# EAGLE design 03-ToF (EAGLE 9.6.2)

## Sheet 1 of 3
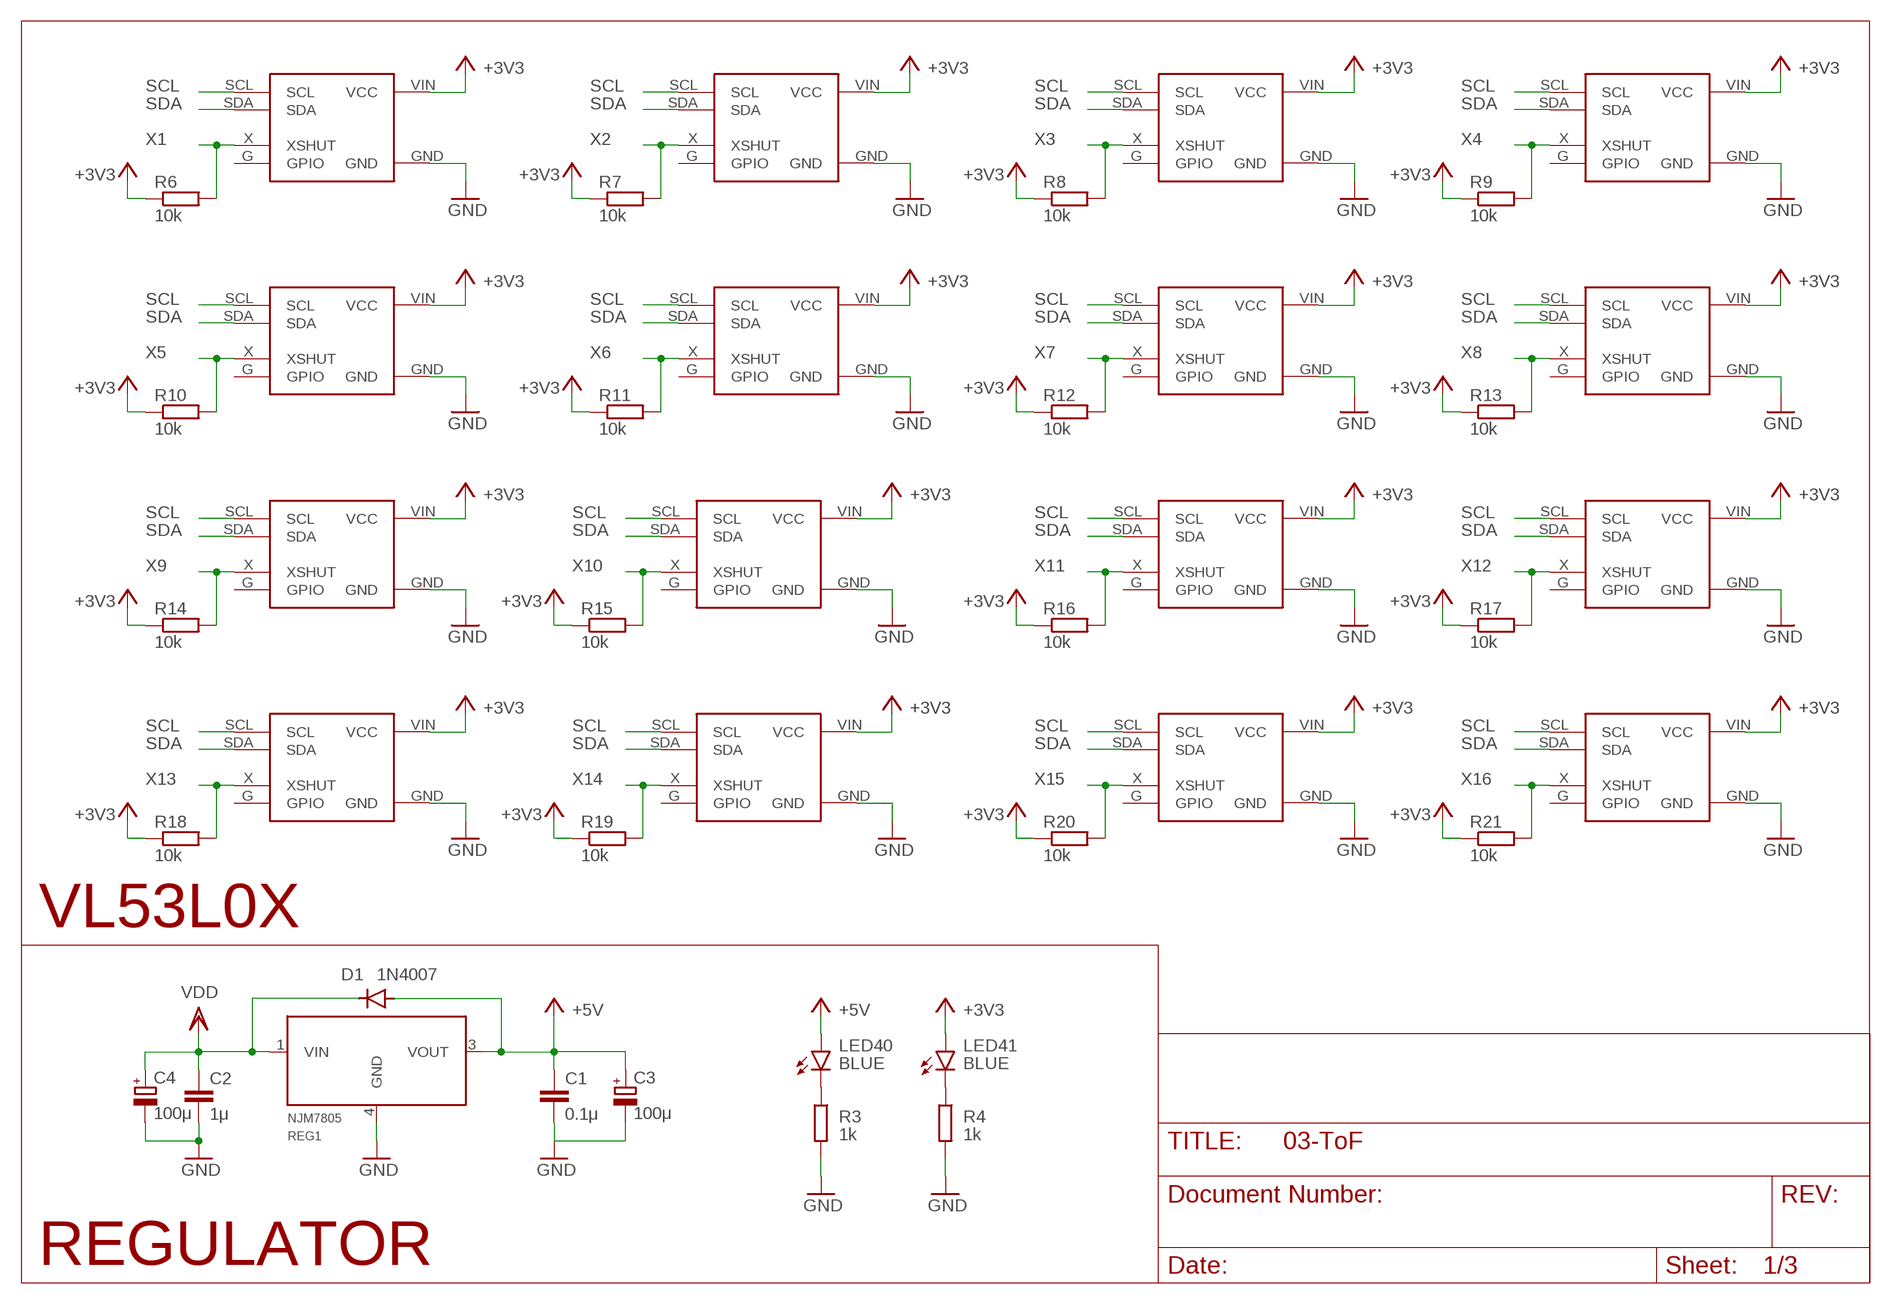
[diagram p0: schematic, sheet 1]

### Parts
C1  0.1μ  C-EUC0402  [C0402]
C2  1μ  C-EUC0402  [C0402]
C3  100μ  CPOL-EU153CLV-0505  [153CLV-0505]
C4  100μ  CPOL-EU153CLV-0505  [153CLV-0505]
D1  1N4007  GF1  [SMA-DO214AC]
LED40  BLUE  LEDSML0603  [SML0603]
LED41  BLUE  LEDSML0603  [SML0603]
R3  1k  R-EU_R0402  [R0402]
R4  1k  R-EU_R0402  [R0402]
R6  10k  R-EU_R0402  [R0402]
R7  10k  R-EU_R0402  [R0402]
R8  10k  R-EU_R0402  [R0402]
R9  10k  R-EU_R0402  [R0402]
R10  10k  R-EU_R0402  [R0402]
R11  10k  R-EU_R0402  [R0402]
R12  10k  R-EU_R0402  [R0402]
R13  10k  R-EU_R0402  [R0402]
R14  10k  R-EU_R0402  [R0402]
R15  10k  R-EU_R0402  [R0402]
R16  10k  R-EU_R0402  [R0402]
R17  10k  R-EU_R0402  [R0402]
R18  10k  R-EU_R0402  [R0402]
R19  10k  R-EU_R0402  [R0402]
R20  10k  R-EU_R0402  [R0402]
R21  10k  R-EU_R0402  [R0402]
REG1  NJM7805  MYPARTS_NJM7800S-REGULATOR  [MYPARTS_D-PAK_TO252AA]
VL1  VL53L0X  [1X04]
VL2  VL53L0X  [1X04]
VL3  VL53L0X  [1X04]
VL4  VL53L0X  [1X04]
VL5  VL53L0X  [1X04]
VL6  VL53L0X  [1X04]
VL7  VL53L0X  [1X04]
VL8  VL53L0X  [1X04]
VL9  VL53L0X  [1X04]
VL10  VL53L0X  [1X04]
VL11  VL53L0X  [1X04]
VL12  VL53L0X  [1X04]
VL13  VL53L0X  [1X04]
VL14  VL53L0X  [1X04]
VL15  VL53L0X  [1X04]
VL16  VL53L0X  [1X04]

### Nets
+3V3 [PWR]: LED41.A R6.1 R7.1 R8.1 R9.1 R10.1 R11.1 R12.1 R13.1 R14.1 R15.1 R16.1 R17.1 R18.1 R19.1 R20.1 R21.1 VL1.VIN(VCC) VL2.VIN(VCC) VL3.VIN(VCC) VL4.VIN(VCC) VL5.VIN(VCC) VL6.VIN(VCC) VL7.VIN(VCC) VL8.VIN(VCC) VL9.VIN(VCC) VL10.VIN(VCC) VL11.VIN(VCC) VL12.VIN(VCC) VL13.VIN(VCC) VL14.VIN(VCC) VL15.VIN(VCC) VL16.VIN(VCC) ; also sheet 2
+5V [PWR]: C1.1 C3.+ D1.A LED40.A REG1.3(VOUT) ; also sheet 2,3
GND [PWR]: C1.2 C2.2 C3.- C4.- R3.2 R4.2 REG1.4(GND) VL1.GND VL2.GND VL3.GND VL4.GND VL5.GND VL6.GND VL7.GND VL8.GND VL9.GND VL10.GND VL11.GND VL12.GND VL13.GND VL14.GND VL15.GND VL16.GND ; also sheet 2,3
N$23: LED40.C R3.1
N$24: LED41.C R4.1
SCL: VL1.SCL VL2.SCL VL3.SCL VL4.SCL VL5.SCL VL6.SCL VL7.SCL VL8.SCL VL9.SCL VL10.SCL VL11.SCL VL12.SCL VL13.SCL VL14.SCL VL15.SCL VL16.SCL ; also sheet 2
SDA: VL1.SDA VL2.SDA VL3.SDA VL4.SDA VL5.SDA VL6.SDA VL7.SDA VL8.SDA VL9.SDA VL10.SDA VL11.SDA VL12.SDA VL13.SDA VL14.SDA VL15.SDA VL16.SDA ; also sheet 2
VDD [PWR]: C2.1 C4.+ D1.K(C) REG1.1(VIN) ; also sheet 2
X1 [XSHUT]: R6.2 VL1.X(XSHUT) ; also sheet 2
X2 [XSHUT]: R7.2 VL2.X(XSHUT) ; also sheet 2
X3 [XSHUT]: R8.2 VL3.X(XSHUT) ; also sheet 2
X4 [XSHUT]: R9.2 VL4.X(XSHUT) ; also sheet 2
X5 [XSHUT]: R10.2 VL5.X(XSHUT) ; also sheet 2
X6 [XSHUT]: R11.2 VL6.X(XSHUT) ; also sheet 2
X7 [XSHUT]: R12.2 VL7.X(XSHUT) ; also sheet 2
X8 [XSHUT]: R13.2 VL8.X(XSHUT) ; also sheet 2
X9 [XSHUT]: R14.2 VL9.X(XSHUT) ; also sheet 2
X10 [XSHUT]: R15.2 VL10.X(XSHUT) ; also sheet 2
X11 [XSHUT]: R16.2 VL11.X(XSHUT) ; also sheet 2
X12 [XSHUT]: R17.2 VL12.X(XSHUT) ; also sheet 2
X13 [XSHUT]: R18.2 VL13.X(XSHUT) ; also sheet 2
X14 [XSHUT]: R19.2 VL14.X(XSHUT) ; also sheet 2
X15 [XSHUT]: R20.2 VL15.X(XSHUT) ; also sheet 2
X16 [XSHUT]: R21.2 VL16.X(XSHUT) ; also sheet 2
Unconnected: VL1.G(GPIO) VL2.G(GPIO) VL3.G(GPIO) VL4.G(GPIO) VL5.G(GPIO) VL6.G(GPIO) VL7.G(GPIO) VL8.G(GPIO) VL9.G(GPIO) VL10.G(GPIO) VL11.G(GPIO) VL12.G(GPIO) VL13.G(GPIO) VL14.G(GPIO) VL15.G(GPIO) VL16.G(GPIO)

### Notes on the sheet
- VL53L0X
- REGULATOR

## Sheet 2 of 3
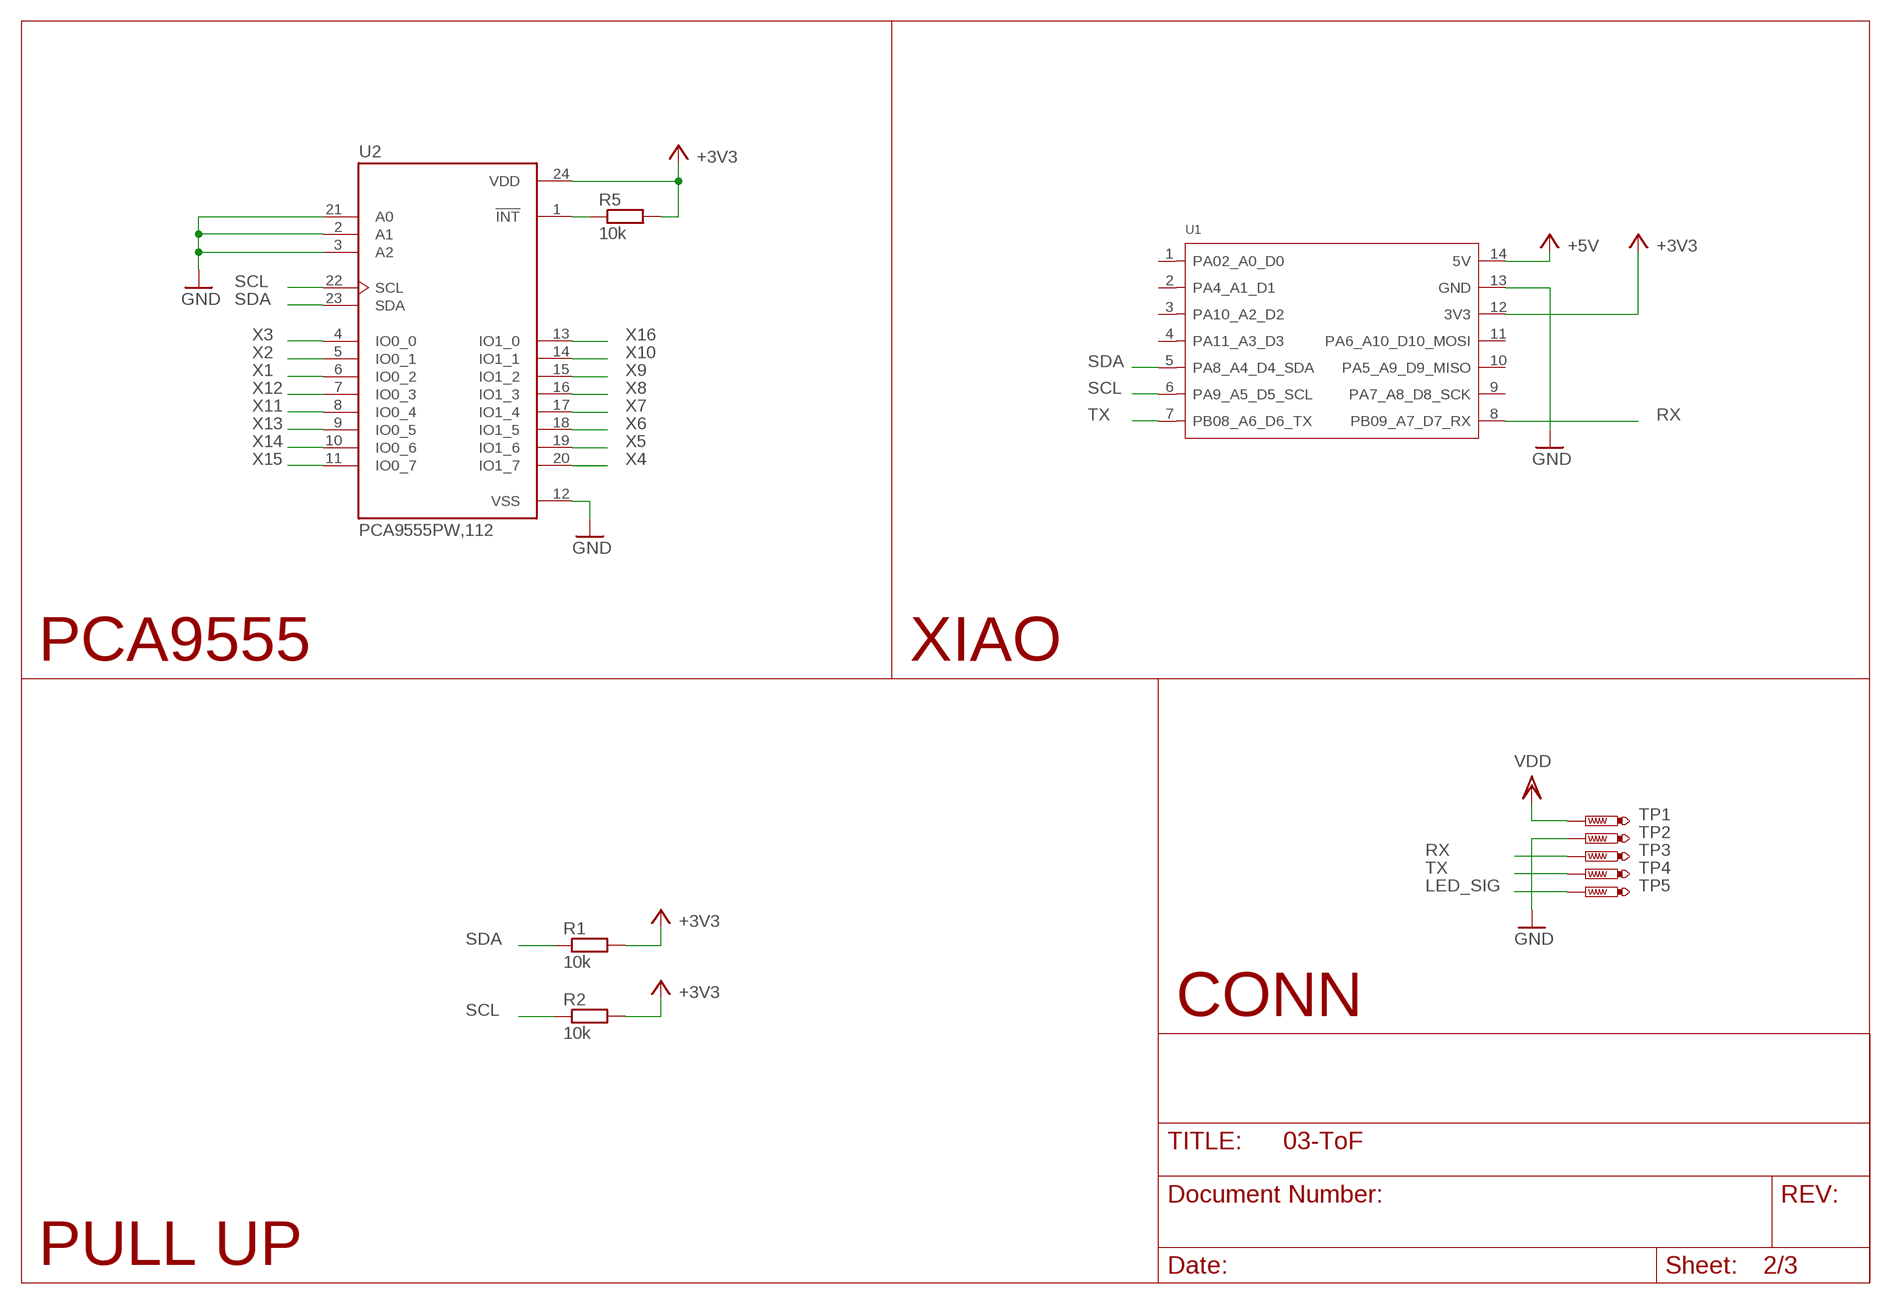
[diagram p1: schematic, sheet 2]

### Parts
R1  10k  R-EU_R0402  [R0402]
R2  10k  R-EU_R0402  [R0402]
R5  10k  R-EU_R0402  [R0402]
TP1  PTR1TP10R  [TP10R]
TP2  PTR1TP10SQ  [TP10SQ]
TP3  PTR1TP10R  [TP10R]
TP4  PTR1TP10R  [TP10R]
TP5  PTR1TP10R  [TP10R]
U1  MOUDLE-SEEEDUINO-XIAO  [MOUDLE14P-2.54-21X17.8MM]
U2  PCA9555PW,112  [SOP65P640X110-24N]

### Nets
+3V3 [PWR]: R1.2 R2.2 R5.2 U1.12(3V3) U2.24(VDD) ; also sheet 1
+5V [PWR]: U1.14(5V) ; also sheet 1,3
GND [PWR]: TP2.TP U1.13(GND) U2.2(A1) U2.3(A2) U2.12(VSS) U2.21(A0) ; also sheet 1,3
LED_SIG: TP5.TP ; also sheet 3
N$25: R5.1 U2.1(!INT)
RX: TP3.TP U1.8(PB09_A7_D7_RX)
SCL: R2.1 U1.6(PA9_A5_D5_SCL) U2.22(SCL) ; also sheet 1
SDA: R1.1 U1.5(PA8_A4_D4_SDA) U2.23(SDA) ; also sheet 1
TX: TP4.TP U1.7(PB08_A6_D6_TX)
VDD [PWR]: TP1.TP ; also sheet 1
X1 [XSHUT]: U2.6(IO0_2) ; also sheet 1
X2 [XSHUT]: U2.5(IO0_1) ; also sheet 1
X3 [XSHUT]: U2.4(IO0_0) ; also sheet 1
X4 [XSHUT]: U2.20(IO1_7) ; also sheet 1
X5 [XSHUT]: U2.19(IO1_6) ; also sheet 1
X6 [XSHUT]: U2.18(IO1_5) ; also sheet 1
X7 [XSHUT]: U2.17(IO1_4) ; also sheet 1
X8 [XSHUT]: U2.16(IO1_3) ; also sheet 1
X9 [XSHUT]: U2.15(IO1_2) ; also sheet 1
X10 [XSHUT]: U2.14(IO1_1) ; also sheet 1
X11 [XSHUT]: U2.8(IO0_4) ; also sheet 1
X12 [XSHUT]: U2.7(IO0_3) ; also sheet 1
X13 [XSHUT]: U2.9(IO0_5) ; also sheet 1
X14 [XSHUT]: U2.10(IO0_6) ; also sheet 1
X15 [XSHUT]: U2.11(IO0_7) ; also sheet 1
X16 [XSHUT]: U2.13(IO1_0) ; also sheet 1
Unconnected: U1.1(PA02_A0_D0) U1.2(PA4_A1_D1) U1.3(PA10_A2_D2) U1.4(PA11_A3_D3) U1.9(PA7_A8_D8_SCK) U1.10(PA5_A9_D9_MISO) U1.11(PA6_A10_D10_MOSI)

### Notes on the sheet
- PCA9555 | XIAO
- CONN
- PULL UP

## Sheet 3 of 3
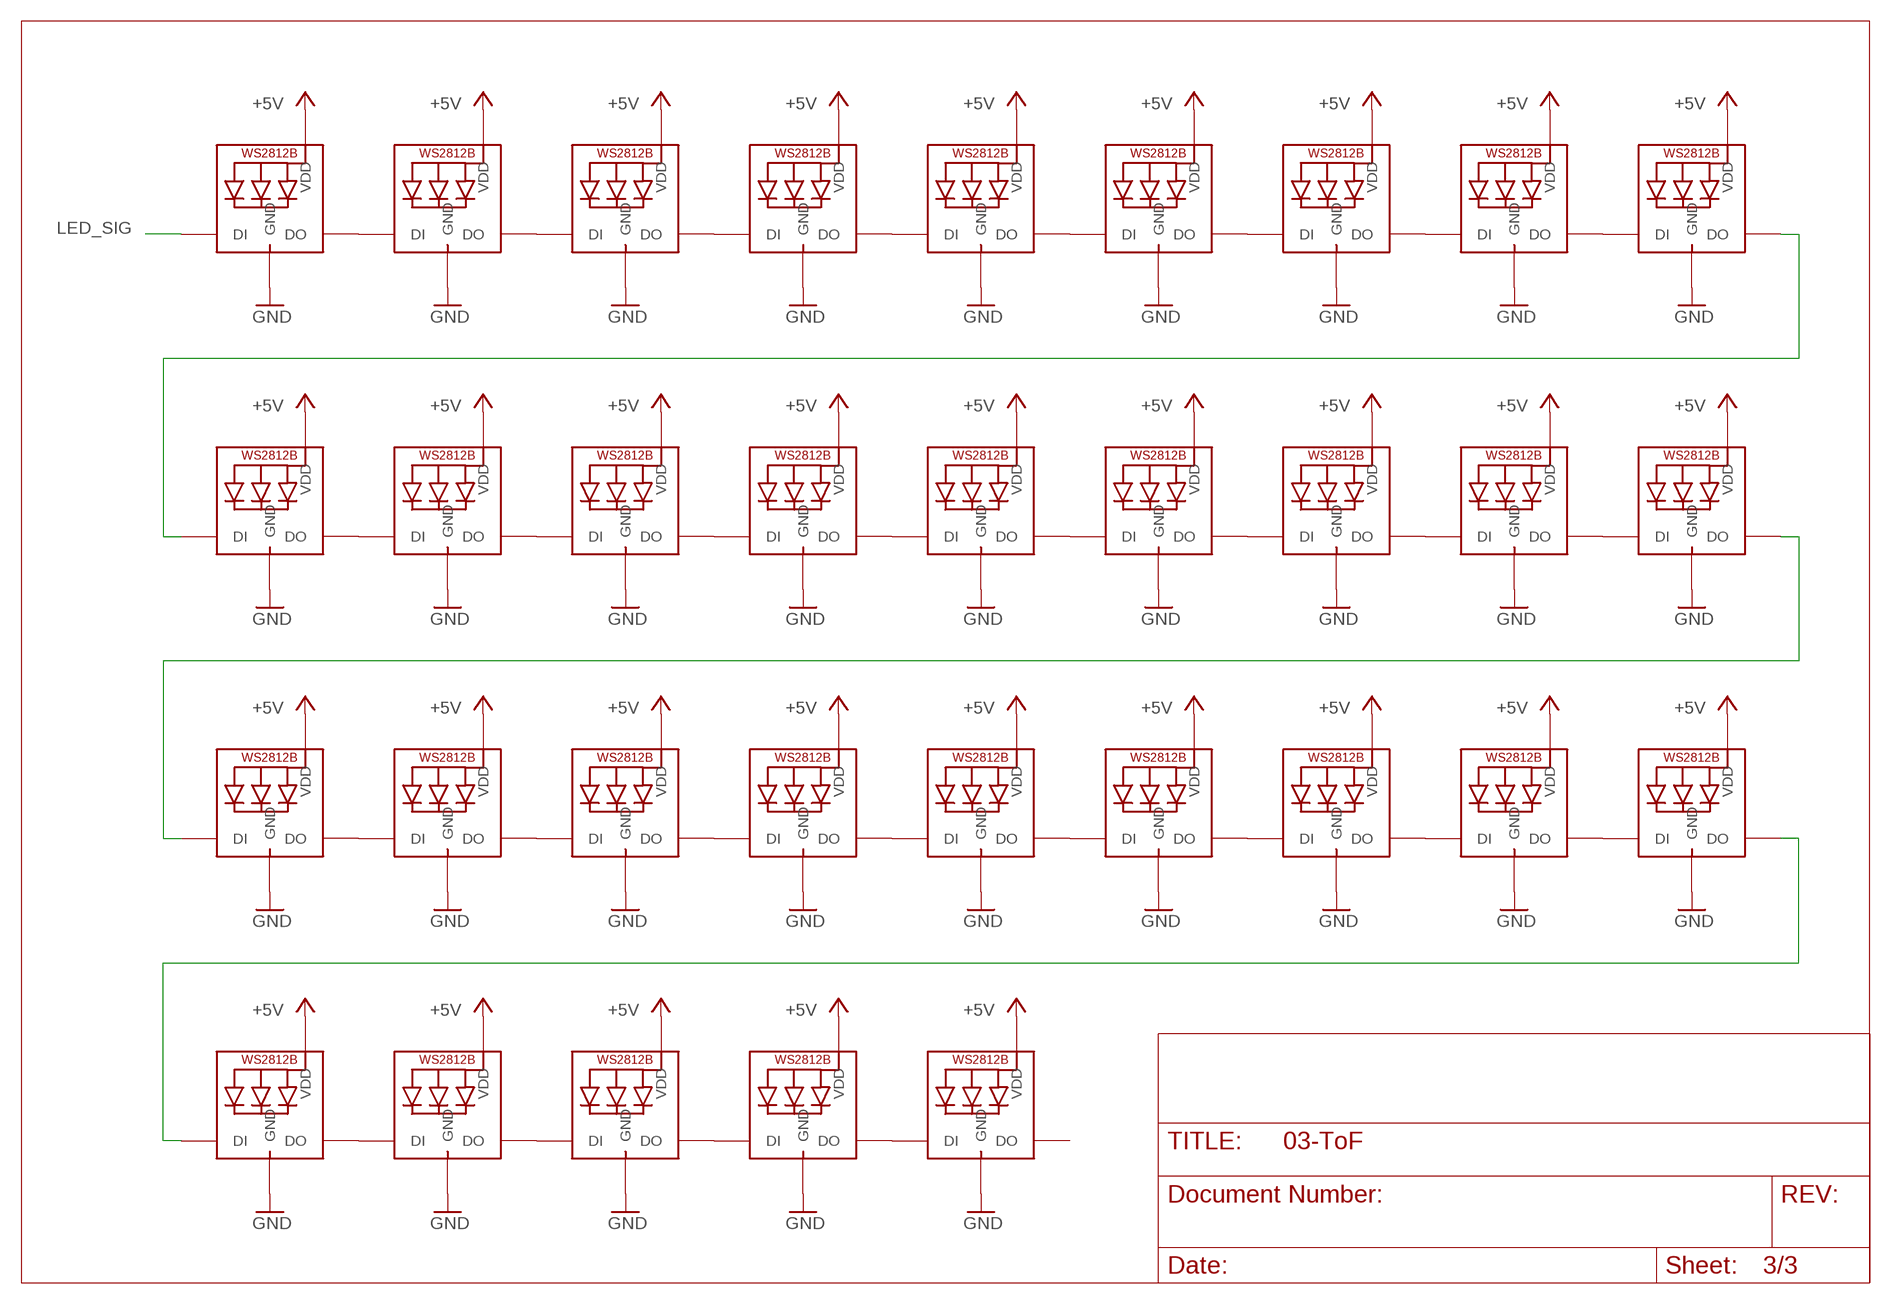
[diagram p2: schematic, sheet 3]

### Parts
LED1  WS2812B_5050N  [WS2812B-NARROW]
LED2  WS2812B_5050N  [WS2812B-NARROW]
LED3  WS2812B_5050N  [WS2812B-NARROW]
LED4  WS2812B_5050N  [WS2812B-NARROW]
LED5  WS2812B_5050N  [WS2812B-NARROW]
LED6  WS2812B_5050N  [WS2812B-NARROW]
LED7  WS2812B_5050N  [WS2812B-NARROW]
LED8  WS2812B_5050N  [WS2812B-NARROW]
LED9  WS2812B_5050N  [WS2812B-NARROW]
LED10  WS2812B_5050N  [WS2812B-NARROW]
LED11  WS2812B_5050N  [WS2812B-NARROW]
LED12  WS2812B_5050N  [WS2812B-NARROW]
LED13  WS2812B_5050N  [WS2812B-NARROW]
LED14  WS2812B_5050N  [WS2812B-NARROW]
LED15  WS2812B_5050N  [WS2812B-NARROW]
LED16  WS2812B_5050N  [WS2812B-NARROW]
LED17  WS2812B_5050N  [WS2812B-NARROW]
LED18  WS2812B_5050N  [WS2812B-NARROW]
LED19  WS2812B_5050N  [WS2812B-NARROW]
LED20  WS2812B_5050N  [WS2812B-NARROW]
LED21  WS2812B_5050N  [WS2812B-NARROW]
LED22  WS2812B_5050N  [WS2812B-NARROW]
LED23  WS2812B_5050N  [WS2812B-NARROW]
LED24  WS2812B_5050N  [WS2812B-NARROW]
LED25  WS2812B_5050N  [WS2812B-NARROW]
LED26  WS2812B_5050N  [WS2812B-NARROW]
LED27  WS2812B_5050N  [WS2812B-NARROW]
LED28  WS2812B_5050N  [WS2812B-NARROW]
LED29  WS2812B_5050N  [WS2812B-NARROW]
LED30  WS2812B_5050N  [WS2812B-NARROW]
LED31  WS2812B_5050N  [WS2812B-NARROW]
LED32  WS2812B_5050N  [WS2812B-NARROW]

### Nets
+5V [PWR]: LED1.1-VDD(VDD) LED2.1-VDD(VDD) LED3.1-VDD(VDD) LED4.1-VDD(VDD) LED5.1-VDD(VDD) LED6.1-VDD(VDD) LED7.1-VDD(VDD) LED8.1-VDD(VDD) LED9.1-VDD(VDD) LED10.1-VDD(VDD) LED11.1-VDD(VDD) LED12.1-VDD(VDD) LED13.1-VDD(VDD) LED14.1-VDD(VDD) LED15.1-VDD(VDD) LED16.1-VDD(VDD) LED17.1-VDD(VDD) LED18.1-VDD(VDD) LED19.1-VDD(VDD) LED20.1-VDD(VDD) LED21.1-VDD(VDD) LED22.1-VDD(VDD) LED23.1-VDD(VDD) LED24.1-VDD(VDD) LED25.1-VDD(VDD) LED26.1-VDD(VDD) LED27.1-VDD(VDD) LED28.1-VDD(VDD) LED29.1-VDD(VDD) LED30.1-VDD(VDD) LED31.1-VDD(VDD) LED32.1-VDD(VDD) ; also sheet 1,2
GND [PWR]: LED1.3-GND(GND) LED2.3-GND(GND) LED3.3-GND(GND) LED4.3-GND(GND) LED5.3-GND(GND) LED6.3-GND(GND) LED7.3-GND(GND) LED8.3-GND(GND) LED9.3-GND(GND) LED10.3-GND(GND) LED11.3-GND(GND) LED12.3-GND(GND) LED13.3-GND(GND) LED14.3-GND(GND) LED15.3-GND(GND) LED16.3-GND(GND) LED17.3-GND(GND) LED18.3-GND(GND) LED19.3-GND(GND) LED20.3-GND(GND) LED21.3-GND(GND) LED22.3-GND(GND) LED23.3-GND(GND) LED24.3-GND(GND) LED25.3-GND(GND) LED26.3-GND(GND) LED27.3-GND(GND) LED28.3-GND(GND) LED29.3-GND(GND) LED30.3-GND(GND) LED31.3-GND(GND) LED32.3-GND(GND) ; also sheet 1,2
LED_SIG: LED1.4-DIN(DI) ; also sheet 2
N$1: LED1.2-DOUT(DO) LED2.4-DIN(DI)
N$2: LED2.2-DOUT(DO) LED3.4-DIN(DI)
N$3: LED3.2-DOUT(DO) LED4.4-DIN(DI)
N$4: LED4.2-DOUT(DO) LED5.4-DIN(DI)
N$5: LED5.2-DOUT(DO) LED6.4-DIN(DI)
N$6: LED6.2-DOUT(DO) LED7.4-DIN(DI)
N$7: LED7.2-DOUT(DO) LED8.4-DIN(DI)
N$8: LED8.2-DOUT(DO) LED9.4-DIN(DI)
N$9: LED10.2-DOUT(DO) LED11.4-DIN(DI)
N$10: LED11.2-DOUT(DO) LED12.4-DIN(DI)
N$11: LED12.2-DOUT(DO) LED13.4-DIN(DI)
N$12: LED13.2-DOUT(DO) LED14.4-DIN(DI)
N$13: LED14.2-DOUT(DO) LED15.4-DIN(DI)
N$14: LED15.2-DOUT(DO) LED16.4-DIN(DI)
N$15: LED16.2-DOUT(DO) LED17.4-DIN(DI)
N$16: LED17.2-DOUT(DO) LED18.4-DIN(DI)
N$17: LED19.2-DOUT(DO) LED20.4-DIN(DI)
N$18: LED20.2-DOUT(DO) LED21.4-DIN(DI)
N$19: LED21.2-DOUT(DO) LED22.4-DIN(DI)
N$20: LED22.2-DOUT(DO) LED23.4-DIN(DI)
N$21: LED23.2-DOUT(DO) LED24.4-DIN(DI)
N$22: LED24.2-DOUT(DO) LED25.4-DIN(DI)
N$26: LED25.2-DOUT(DO) LED26.4-DIN(DI)
N$27: LED26.2-DOUT(DO) LED27.4-DIN(DI)
N$28: LED9.2-DOUT(DO) LED10.4-DIN(DI)
N$29: LED28.2-DOUT(DO) LED29.4-DIN(DI)
N$30: LED29.2-DOUT(DO) LED30.4-DIN(DI)
N$31: LED30.2-DOUT(DO) LED31.4-DIN(DI)
N$32: LED31.2-DOUT(DO) LED32.4-DIN(DI)
N$33: LED18.2-DOUT(DO) LED19.4-DIN(DI)
N$34: LED27.2-DOUT(DO) LED28.4-DIN(DI)
Unconnected: LED32.2-DOUT(DO)

## Library data of the parts
C1 C2 = rcl:C-EU: CAPACITOR, European symbol; SPICEPREFIX: C
C3 C4 = rcl:CPOL-EU: POLARIZED CAPACITOR, European symbol; SPICEPREFIX: C
D1 = diode:GF1: DIODE
LED1-LED32 = microbuilder:WS2812B
LED40 LED41 = led:LED: LED OSRAM: - CHIPLED LG R971, LG N971, LY N971, LG Q971, LY Q971, LO R971, LY R971 LH N974, LH R974 LS Q976, LO Q976, LY Q976 LO Q996 - Hyper CHIPLED LW Q18S LB Q993, LB Q99A, LB R99A - SideLED LS A670, LO A670, LY A670, LG A670, LP A670 LB A673, LV A673, LT A673, LW A673 LH A674 LY A675 LS A676, LA A676, LO A676, LY A676, LW A676 LS A679, LY A679, LG A679 - Hyper Micro SIDELED® LS Y876, LA Y876, LO Y876, LY Y876 LT Y87S - SmartLED LW L88C, LW L88S LB L89C, LB L89S, LG L890 LS L89K, LO L89K, LY L89K LS L896, LA L896, LO L896, LY L896 - TOPLED LS T670, LO T670, LY T670, LG T670, LP T670 LSG T670, LSP T670, LSY T670, LOP T670, LYG T670 LG T671, LOG T671, LSG T671 LB T673, LV T673, LT T673, LW T673 LH T674 LS T676, LA T676, LO T676, LY T676, LB T676, LH T676, LSB T676, LW T676 LB T67C, LV T67C, LT T67C, LS T67K, LO T67K, LY T67K, LW E67C LS E67B, LA E67B, LO E67B, LY E67B, LB E67C, LV E67C, LT E67C LW T67C LS T679, LY T679, LG T679 LS T770, LO T770, LY T770, LG T770, LP T770 LB T773, LV T773, LT T773, LW T773 LH T774 LS E675, LA E675, LY E675, LS T675 LS T776, LA T776, LO T776, LY T776, LB T776 LHGB T686 LT T68C, LB T68C - Hyper Mini TOPLED® LB M676 - Mini TOPLED Santana® LG M470 LS M47K, LO M47K, LY M47K Source: http://www.osram.convergy.de LUXEON: - LUMILED® LXK2-PW12-R00, LXK2-PW12-S00, LXK2-PW14-U00, LXK2-PW14-V00 LXK2-PM12-R00, LXK2-PM12-S00, LXK2-PM14-U00 LXK2-PE12-Q00, LXK2-PE12-R00, LXK2-PE12-S00, LXK2-PE14-T00, LXK2-PE14-U00 LXK2-PB12-K00, LXK2-PB12-L00, LXK2-PB12-M00, LXK2-PB14-N00, LXK2-PB14-P00, LXK2-PB14-Q00 LXK2-PR12-L00, LXK2-PR12-M00, LXK2-PR14-Q00, LXK2-PR14-R00 LXK2-PD12-Q00, LXK2-PD12-R00, LXK2-PD12-S00 LXK2-PH12-R00, LXK2-PH12-S00 LXK2-PL12-P00, LXK2-PL12-Q00, LXK2-PL12-R00 Source: www.luxeon.com KINGBRIGHT: KA-3528ASYC Source: www.kingbright.com
R1-R21 = rcl:R-EU_: RESISTOR, European symbol; SPICEPREFIX: R
REG1 = #001-line:MYPARTS_NJM7800S-REGULATOR
TP1-TP5 = testpad:PTR1: TEST PIN
U1 = Seeeduino XIAO:MOUDLE-SEEEDUINO-XIAO
U2 = PCA9555PW_112:PCA9555PW,112: Check availability <https://pricing.snapeda.com/parts/PCA9555PW%2C112/NXP%20Semiconductors/view-part?ref=eda>; AVAILABILITY: In Stock; DESCRIPTION: Interface IC - I/O extensions NXP Semiconductors PCA9555PW, 112 POR I²C, SMBus 400 kHz TSSOP 24; MF: NXP Semiconductors; MP: PCA9555PW,112; PACKAGE: TSSOP-24 NXP Semiconductors; PRICE: None; PURCHASE-URL: https://pricing.snapeda.com/search/part/PCA9555PW,112/?ref=eda
VL1-VL16 = VL53L0X:VL53L0X

## Net classes
0 default: width 0.381 mm
1 PWR: width 0.381 mm
2 XSHUT: width 0.254 mm

## Board
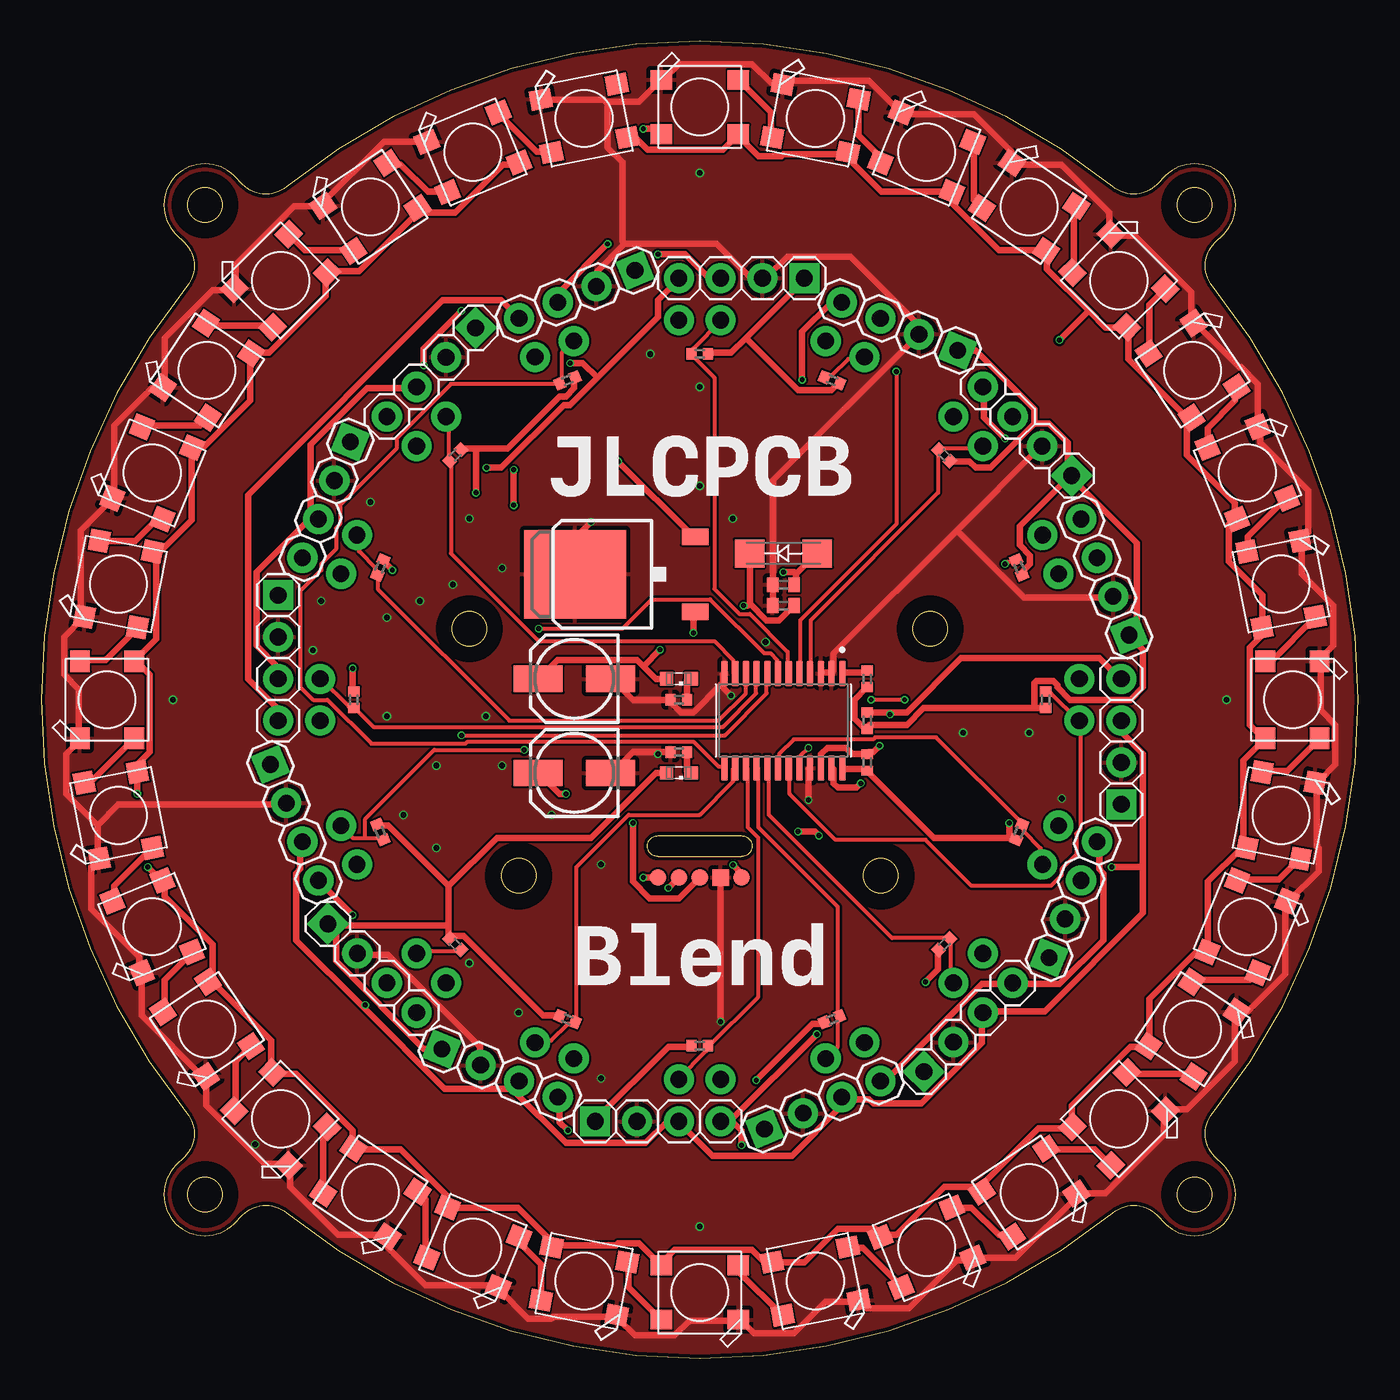
[diagram p3: board, top side]
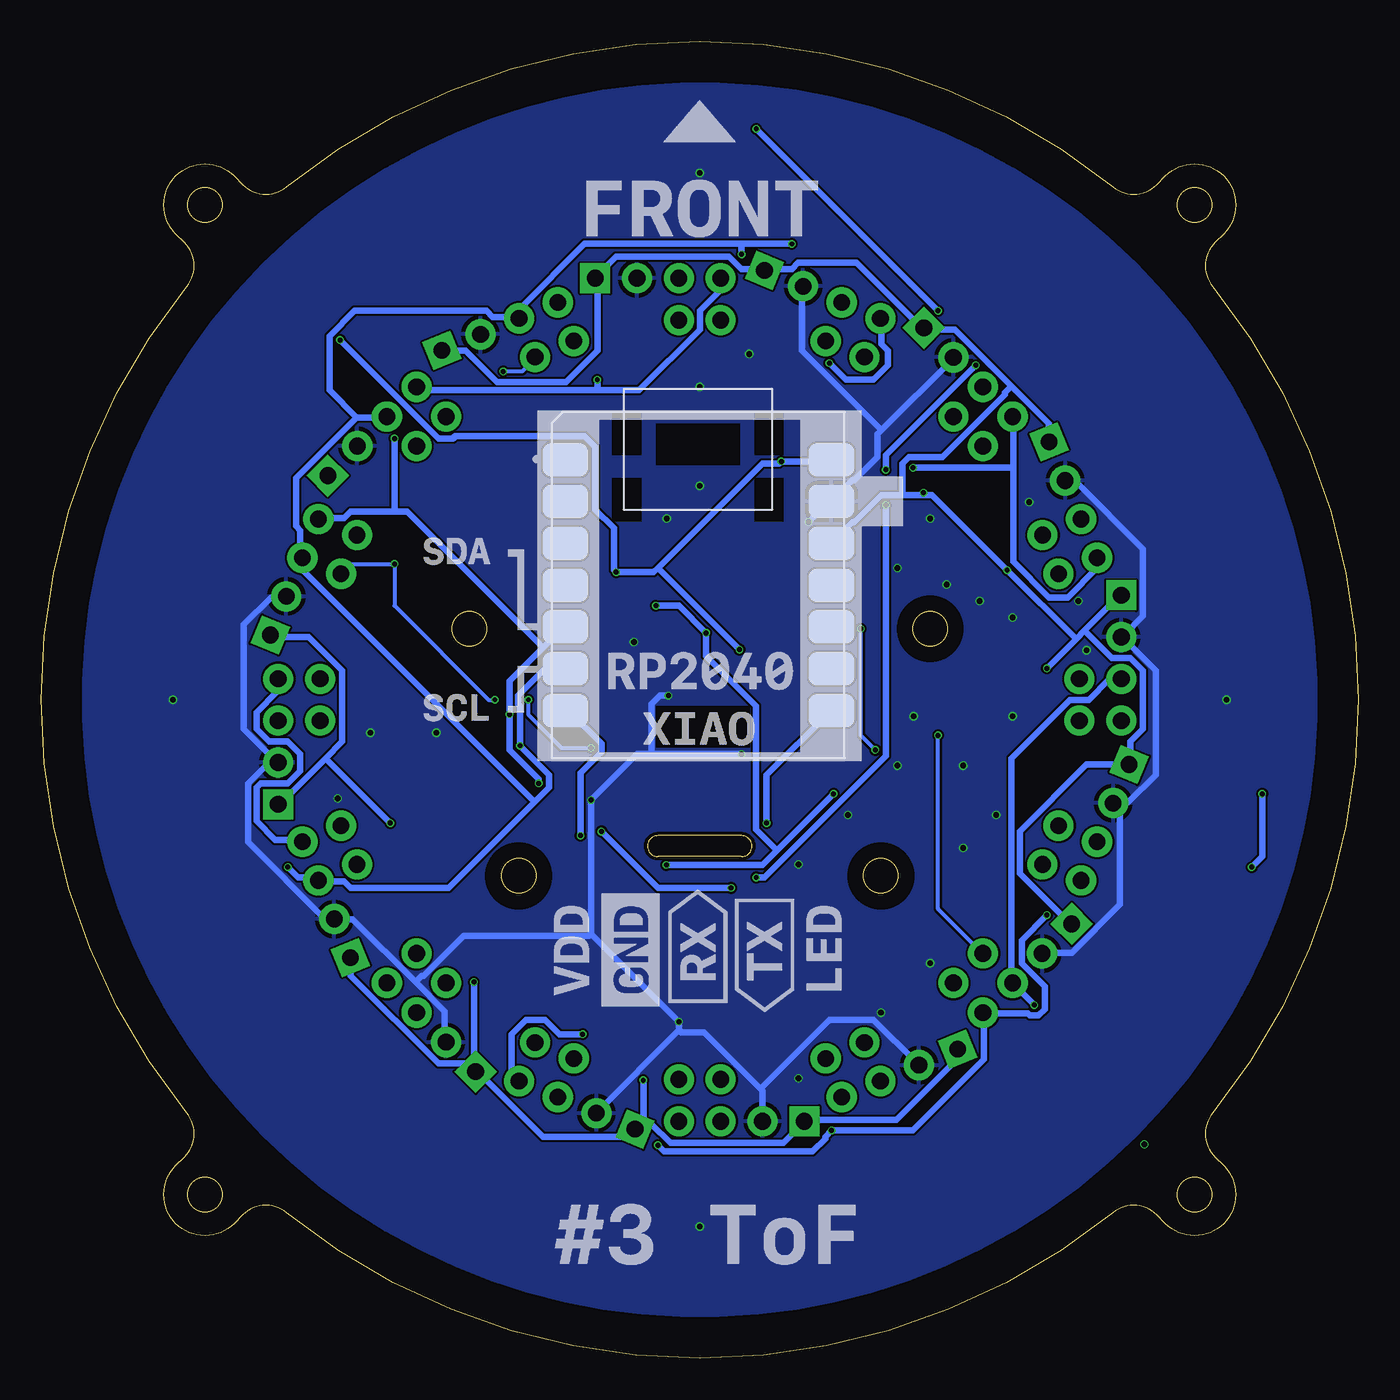
[diagram p4: board, bottom side, seen from below]

Size 80 x 80 mm. Coordinates in mm from the lower left corner, seen from the top.
Outline: 65.09,71.15 arc78 14.91,71.15 arc-84 12.24,71.3 11.72,71.82 arc180 8.18,68.28 8.71,67.76 arc-84 8.85,65.09 arc78 8.85,14.91 arc-84 8.71,12.24 8.18,11.72 arc180 11.72,8.18 12.24,8.71 arc-84 14.91,8.85 arc78 65.09,8.85 arc-84 67.76,8.71 68.28,8.18 arc180 71.82,11.72 71.3,12.24 arc-84 71.15,14.91 arc78 71.15,65.09 arc-84 71.3,67.76 71.82,68.28 arc180 68.28,71.82 67.76,71.3 arc-84 65.09,71.15
Outline: 37.46,31.75 42.54,31.75 arc-180 42.54,30.48 37.46,30.48 arc-180 37.46,31.75
Outline: circle at 51,29.3 radius 1.05
Outline: circle at 54,44.3 radius 1.05
Outline: circle at 29,29.3 radius 1.05
Outline: circle at 70.05,70.05 radius 1.05
Outline: circle at 70.05,9.95 radius 1.05
Outline: circle at 9.95,9.95 radius 1.05
Outline: circle at 9.95,70.05 radius 1.05
Outline: circle at 26,44.3 radius 1.05
Copper layers (1*16): Top 0.035mm / dielectric 1.6mm / Bottom 0.035mm
Design rules "jlcpcb-2layers": minimum track width 5mil, minimum drill 0.3mm, track to track 5mil, track to pad 5mil, pad to pad 5mil, via to via 5mil, smd to smd 5mil, copper to edge 0.2mm, drill to drill 6mil, minimum pad ring 10mil, minimum via ring 3mil, stop-mask expansion 4mil, vias tented up to drill 0mil, thermal gap 10mil
tRestrict: area 52,42.3 to 56,46.3; area 27,27.3 to 31,31.3; area 24,42.3 to 28,46.3; area 7.9,68.1 to 11.9,72.1; area 49,27.3 to 53,31.3; area 68.1,68.1 to 72.1,72.1; area 68.1,7.9 to 72.1,11.9; area 7.9,7.9 to 11.9,11.9
bRestrict: area 49,27.3 to 53,31.3; area 68.1,68.1 to 72.1,72.1; area 68.1,7.9 to 72.1,11.9; area 7.9,7.9 to 11.9,11.9; area 52,42.3 to 56,46.3; area 24,42.3 to 28,46.3; area 27,27.3 to 31,31.3; area 7.9,68.1 to 11.9,72.1

### Footprints (pad centres in the part's own frame; a part is rotated, then mirrored left to right if it is on the bottom)
C0402 = smd 0.7 x 0.9: 1 -0.65,0; 2 0.65,0
153CLV-0505 = smd 3 x 1.6: + 2.2,0; - -2.2,0
SMA-DO214AC = smd 1.8 x 1.7: A -2.05,0; K 2.05,0
WS2812B-NARROW = smd 1.3 x 1.2: 1-VDD 2.35,-1.65; 2-DOUT 2.35,1.65; 3-GND -2.35,1.65; 4-DIN -2.35,-1.65
SML0603 = smd 0.8 x 0.8: A 0.75,0; C -0.75,0
R0402 = smd 0.6 x 0.7: 1 -0.5,0; 2 0.5,0
MYPARTS_D-PAK_TO252AA = smd 1 x 1.6: 1 -2.28,-4.8; 3 2.28,-4.8 | smd 5.4 x 6.2: 4 0,2.5
TP10R = smd 1 x 1: TP 0,0
TP10SQ = smd 1 x 1: TP 0,0
MOUDLE14P-2.54-21X17.8MM = smd 2.75 x 2: 1 0.835,18.12; 2 0.835,15.58; 3 0.835,13.04; 4 0.835,10.5; 5 0.835,7.96; 6 0.835,5.42; 7 0.835,2.88; 8 17,2.88; 9 17,5.42; 10 17,7.96; 11 17,10.5; 12 17,13.04; 13 17,15.58; 14 17,18.12
SOP65P640X110-24N = smd 1.57 x 0.41: 1 -2.87,3.575; 2 -2.87,2.925; 3 -2.87,2.275; 4 -2.87,1.625; 5 -2.87,0.975; 6 -2.87,0.325; 7 -2.87,-0.325; 8 -2.87,-0.975; 9 -2.87,-1.625; 10 -2.87,-2.275; 11 -2.87,-2.925; 12 -2.87,-3.575; 13 2.87,-3.575; 14 2.87,-2.925; 15 2.87,-2.275; 16 2.87,-1.625; 17 2.87,-0.975; 18 2.87,-0.325; 19 2.87,0.325; 20 2.87,0.975; 21 2.87,1.625; 22 2.87,2.275; 23 2.87,2.925; 24 2.87,3.575
1X04 = drill 1.016: G -1.27,-2.54; GND 3.81,0; SCL 1.27,0; SDA -1.27,0; X 1.27,-2.54 | drill 1.016 square: VIN 6.35,0

### Placement (x,y rotation side)
C1  45.08,46.99 180 top
C2  45.08,45.72 180 top
C3  32.38,41.27 180 top
C4  32.38,35.56 180 top
D1  45.08,48.89 180 top
LED1  40,76 0 top
LED2  47.02,75.31 348.8 top
LED3  53.78,73.26 337.5 top
LED4  60,69.93 326.3 top
LED5  65.46,65.46 315 top
LED6  69.93,60 303.8 top
LED7  73.26,53.78 292.5 top
LED8  75.31,47.02 281.3 top
LED9  76,40 270 top
LED10  75.31,32.98 258.8 top
LED11  73.26,26.22 247.5 top
LED12  69.93,20 236.3 top
LED13  65.46,14.54 225 top
LED14  60,10.07 213.8 top
LED15  53.78,6.74 202.5 top
LED16  47.02,4.69 191.3 top
LED17  40,4 180 top
LED18  32.98,4.69 168.8 top
LED19  26.22,6.74 157.5 top
LED20  20,10.07 146.3 top
LED21  14.54,14.54 135 top
LED22  10.07,20 123.8 top
LED23  6.74,26.22 112.5 top
LED24  4.69,32.98 101.3 top
LED25  4,40 90 top
LED26  4.69,47.02 78.8 top
LED27  6.74,53.78 67.5 top
LED28  10.07,60 56.3 top
LED29  14.54,65.46 45 top
LED30  20,69.93 33.8 top
LED31  26.22,73.26 22.5 top
LED32  32.98,75.31 11.3 top
LED40  38.73,41.27 180 top
LED41  38.73,35.56 180 top
R1  50.16,38.73 270 top
R2  50.16,36.19 270 top
R3  38.73,40 180 top
R4  38.73,36.83 180 top
R5  50.16,41.27 270 top
R6  40,61 180 top
R7  48.04,59.4 157.5 top
R8  54.85,54.85 135 top
R9  59.4,48.04 112.5 top
R10  61,40 90 top
R11  59.4,31.96 67.5 top
R12  54.85,25.15 45 top
R13  48.04,20.6 22.5 top
R14  40,19 0 top
R15  31.96,20.6 337.5 top
R16  25.15,25.15 315 top
R17  20.6,31.96 292.5 top
R18  19,40 270 top
R19  20.6,48.04 247.5 top
R20  25.15,54.85 225 top
R21  31.96,59.4 202.5 top
REG1  34.92,47.62 90 top
TP1  42.54,29.21 0 top
TP2  41.27,29.21 0 top
TP3  40,29.21 0 top
TP4  38.73,29.21 0 top
TP5  37.46,29.21 0 top
U1  49,36.46 0 bottom
U2  45.08,38.73 270 top
VL1  40,65.6 0 top
VL2  49.8,63.65 337.5 top
VL3  58.1,58.1 315 top
VL4  63.65,49.8 292.5 top
VL5  65.6,40 270 top
VL6  63.65,30.2 247.5 top
VL7  58.1,21.9 225 top
VL8  49.8,16.35 202.5 top
VL9  40,14.4 180 top
VL10  30.2,16.35 157.5 top
VL11  21.9,21.9 135 top
VL12  16.35,30.2 112.5 top
VL13  14.4,40 90 top
VL14  16.35,49.8 67.5 top
VL15  21.9,58.1 45 top
VL16  30.2,63.65 22.5 top

### Tracks (layer width: path | path; a pad name or v marks a point on that pad's centre or on a via)
+3V3  (via drill 0.3)
  Top 0.381: 24.76,28.7 21.08,32.38 20.44,32.38 R17.1 | 24.76,26.28 24.76,25.52 R16.1 24.89,25.65 25.65,25.65 30.48,20.82 31.49,20.82 R15.1 | 24.76,26.28 24.76,28.7 | LED41.A 37.33,35.56 33.4,31.62 27.68,31.62 24.76,28.7 | 24.76,26.28 17.52,26.28 VL11.VIN 17.9,26.16 17.9,24.13 23.24,18.79 24.25,18.79 VL10.VIN | v53.72,22.86 54.48,23.62 54.48,24.76 R12.1 | v43.43,16.89 46.86,20.32 47.49,20.32 R13.1 | R14.1 39.49,18.92 38.1,18.92 33.65,14.47 VL9.VIN | R9.1 59.69,47.62 59.69,47.87 60.07,48.26 60.07,48.76 59.43,49.4 59.43,50.54 62.48,53.59 VL3.VIN | 60.32,56.76 57.65,54.1 56.76,54.1 56.38,54.48 55.24,54.48 R8.1 | 60.32,56.76 61.21,56.76 62.35,55.62 62.35,53.72 VL3.VIN | 60.32,56.76 60.32,57.65 56.76,61.21 55.75,61.21 VL2.VIN | U2.24 48.76,35.81 50.16,35.81 R2.2 50.29,35.56 54.22,31.62 58.8,31.62 | 58.8,31.62 59.18,31.62 R11.1 | R5.2 49.4,40 49.4,38.86 49.91,38.35 50.16,38.35 R1.2 50.29,38.48 52.57,38.48 53.59,39.49 60.32,39.49 | 60.32,39.49 60.96,39.49 R10.1 | 60.32,39.49 60.32,41.02 60.45,41.14 61.46,41.14 61.72,40.89 61.72,40.76 62.48,40 66.16,40 66.92,40.76 66.92,43.05 66.16,43.81 VL4.VIN 66.16,44.06 66.54,44.45 66.54,49.53 62.61,53.46 VL3.VIN | v58.8,32.51 58.8,31.62 | 42.79,61.97 46.35,65.53 VL1.VIN | 42.79,61.97 41.91,61.08 40.51,61.08 R6.1 | 42.79,61.97 45.97,58.8 48,58.8 48.38,59.18 R7.1 | 26.41,55.24 28.32,55.24 31.49,58.42 31.87,58.42 32.38,58.92 32.38,59.56 R21.1 | 26.41,55.24 25.52,55.24 R20.1 | v18.92,41.91 18.92,40.51 R18.1 | v21.33,47.87 20.82,48.38 R19.1 | v26.41,52.57 26.41,55.24
  Bottom 0.381: v53.72,22.86 53.72,17.52 VL7.VIN | VL6.VIN 61.21,24.25 61.21,23.24 55.88,17.9 53.84,17.9 VL7.VIN | v43.43,16.89 43.43,14.35 43.81,13.97 VL8.VIN | VL8.VIN 43.3,14.22 42.92,14.22 41.78,13.08 34.92,13.08 33.65,14.35 VL9.VIN 33.52,14.47 28.06,14.47 24.38,18.16 24.38,18.66 VL10.VIN | VL7.VIN 53.46,17.39 49.53,13.46 44.45,13.46 44.06,13.84 VL8.VIN | 62.73,36.44 61.72,37.46 61.72,41.78 63.75,43.81 66.04,43.81 VL4.VIN | 62.73,36.44 65.53,33.65 VL5.VIN | 62.73,36.44 v58.8,32.51 | 21.08,59.05 24.51,62.48 26.28,62.48 VL15.VIN 26.54,62.61 30.48,66.54 34.03,66.54 34.41,66.16 35.94,66.16 VL16.VIN 36.19,66.16 37.46,66.16 38.22,66.92 45.08,66.92 46.35,65.65 VL1.VIN 46.22,65.53 46.22,61.21 48.13,59.3 52.32,59.3 54.22,61.21 55.62,61.21 VL2.VIN | 21.08,59.05 18.79,56.76 18.79,55.75 VL14.VIN | 16.63,44.19 14.47,46.35 VL13.VIN | 16.63,44.19 17.14,43.68 | 17.14,43.68 v18.92,41.91 | 17.14,43.68 v21.33,47.87 25.9,52.45 26.41,52.45 | 26.41,52.45 27.68,52.45 | 27.68,52.45 28.95,52.45 30.6,50.8 30.73,50.8 32,49.53 U1.12 | 16.63,44.19 14.98,42.54 13.84,42.54 13.08,41.78 13.08,38.22 13.84,37.46 13.84,36.19 VL12.VIN 14.09,36.06 16.51,36.06 20.57,32 20.57,29.46 17.52,26.41 VL11.VIN | v26.41,52.57 26.41,52.45 | 21.08,59.05 21.46,58.67 21.46,58.54 25.27,54.73 27.3,54.73 27.68,54.35 27.68,52.45
+5V  (via drill 0.3)
  Top 0.381: LED40.A 37.33,41.27 36.57,42.03 | 36.57,42.03 36.19,42.41 31.36,42.41 30.22,41.27 C3.+ | 45.84,47.62 45.84,46.99 C1.1 | 45.84,47.62 47.11,48.89 D1.A | v35.05,54.48 39.62,49.91 REG1.3 | v45.08,47.75 45.72,47.75 45.84,47.62 | v37.59,43.05 36.57,42.03 | LED32.1-VDD 35.68,74.04 36.19,74.04 36.83,73.4 41.4,73.4 42.29,74.29 LED1.1-VDD 42.41,74.16 43.56,73.02 44.95,73.02 45.08,73.15 48.89,73.15 LED2.1-VDD 48.89,73.02 51.05,70.86 55.24,70.86 LED3.1-VDD 55.37,70.73 55.37,70.1 58.16,67.31 60.96,67.31 LED4.1-VDD 61.08,67.18 61.08,66.16 63.62,63.62 | 63.62,63.62 64.64,62.61 65.78,62.61 LED5.1-VDD 66.04,62.61 66.04,60.7 69.59,57.15 69.85,57.15 LED6.1-VDD 69.59,57.02 69.59,54.86 72.51,51.94 72.51,51.05 LED7.1-VDD 72.39,50.92 72.13,50.67 72.13,48.38 74.16,46.35 74.16,44.57 LED8.1-VDD 74.04,44.32 74.04,43.81 73.4,43.18 73.4,38.48 74.16,37.71 LED9.1-VDD 74.29,37.59 73.02,36.32 73.02,31.11 LED10.1-VDD 73.15,30.98 72.89,30.98 70.86,28.95 70.86,24.76 LED11.1-VDD 70.73,24.63 70.1,24.63 67.31,21.84 67.31,19.05 LED12.1-VDD 67.18,18.92 66.16,18.92 62.61,15.36 62.61,14.22 LED13.1-VDD 62.61,13.97 60.57,13.97 57.02,10.41 LED14.1-VDD 57.02,10.16 56.76,10.41 54.86,10.41 51.94,7.49 51.05,7.49 LED15.1-VDD 50.92,7.62 50.67,7.87 48.38,7.87 46.35,5.84 44.57,5.84 LED16.1-VDD 44.32,5.96 43.81,5.96 43.18,6.6 38.48,6.6 37.71,5.84 LED17.1-VDD 37.59,5.71 36.32,6.98 35.05,6.98 34.92,6.85 31.11,6.85 LED18.1-VDD 31.11,6.98 28.95,9.14 24.76,9.14 LED19.1-VDD 24.63,9.27 24.63,9.9 21.84,12.7 19.05,12.7 LED20.1-VDD 18.92,12.82 18.92,13.84 15.49,17.27 14.09,17.27 LED21.1-VDD 13.97,17.52 13.97,19.3 10.41,22.86 10.16,22.86 LED22.1-VDD 10.41,22.98 10.41,25.14 7.49,28.06 7.49,28.95 LED23.1-VDD 7.23,29.08 v6.47,29.84
  Top 0.381: 63.62,63.62 v61.84,61.84 | LED31.1-VDD 28.95,72.51 28.06,72.51 25.14,69.59 22.98,69.59 LED30.1-VDD 22.86,69.85 22.86,69.59 19.3,66.04 17.52,66.04 LED29.1-VDD 17.27,65.91 17.27,64.51 13.84,61.08 12.82,61.08 LED28.1-VDD 12.7,60.96 12.7,58.16 9.9,55.37 9.27,55.37 LED27.1-VDD 9.14,55.24 9.14,50.92 7.11,48.89 LED26.1-VDD 6.85,48.89 6.98,48.76 6.98,43.68 5.71,42.41 LED25.1-VDD 5.84,42.29 6.6,41.52 6.6,36.83 5.96,36.19 5.96,35.68 LED24.1-VDD 5.84,35.43 v5.84,34.29
  Bottom 0.381: U1.14 32.13,54.48 v35.05,54.48 35.17,54.35 36.19,54.35 42.54,48 | 42.54,48 42.79,47.75 v45.08,47.75 45.21,47.87 45.21,50.41 46.35,51.56 46.35,55.37 46.99,56 54.86,56 54.99,55.88 55.88,55.88 v61.84,61.84 | 42.54,48 v37.59,43.05 | v5.84,34.29 5.84,30.48 v6.47,29.84
GND  (via drill 0.3, 0.35)
  Top 0.381: C2.2 44.45,45.72 44.45,46.99 C1.2 44.45,47.11 44.45,53.34 53.21,62.1 VL2.GND 53.34,62.35 53.34,62.73 49.14,66.92 45.33,66.92 44.06,65.65 43.81,65.65 VL1.GND 43.68,65.78 42.92,65.78 41.02,67.69 35.43,67.69 | v33.4,50.8 32.51,49.91 32.51,47.62 REG1.4 | 35.43,67.69 33.78,66.04 33.78,65.15 VL16.GND | 34.29,76.32 34.16,76.45 30.48,76.45 LED32.3-GND | 34.29,76.32 36.32,76.32 37.59,77.59 LED1.3-GND 37.84,77.72 38.73,78.61 43.18,78.61 44.32,77.47 44.95,77.47 LED2.3-GND 45.08,77.59 50.29,77.59 52.19,75.69 LED3.3-GND 52.32,75.56 56.64,75.56 58.92,73.27 58.92,72.64 LED4.3-GND 59.05,72.51 61.97,72.51 64.89,69.59 64.89,68.45 LED5.3-GND 65.02,68.19 66.42,68.19 69.85,64.77 69.85,62.99 LED6.3-GND 70.1,62.86 72.77,60.19 72.89,60.19 73.91,59.18 73.91,56.64 LED7.3-GND 74.04,56.51 74.04,55.62 76.96,52.7 76.96,50.16 76.58,49.78 LED8.3-GND 76.58,49.53 76.58,47.62 78.48,45.72 78.48,43.3 77.72,42.54 LED9.3-GND 77.72,42.29 77.72,39.37 78.61,38.48 78.61,36.06 77.59,35.05 LED10.3-GND 77.47,34.92 77.47,31.11 77.59,30.98 77.59,29.59 75.81,27.81 LED11.3-GND 75.56,27.68 75.56,23.36 73.27,21.08 72.64,21.08 LED12.3-GND 72.51,20.95 72.51,18.03 69.59,15.11 68.45,15.11 LED13.3-GND 68.19,14.98 68.19,13.58 64.64,10.03 63.11,10.03 LED14.3-GND 62.99,9.9 59.18,6.09 56.64,6.09 LED15.3-GND 56.51,5.96 55.62,5.96 52.7,3.04 50.16,3.04 49.78,3.42 LED16.3-GND 49.53,3.42 47.62,3.42 45.72,1.52 43.3,1.52 42.54,2.28 LED17.3-GND 42.29,2.28 39.37,2.28 38.48,1.39 36.06,1.39 35.05,2.41 LED18.3-GND 34.92,2.54 31.11,2.54 30.98,2.41 29.59,2.41 27.81,4.19 LED19.3-GND 27.68,4.44 23.36,4.44 21.08,6.73 21.08,7.36 LED20.3-GND 20.95,7.49 18.03,7.49 15.11,10.41 15.11,11.55 LED21.3-GND 14.98,11.81 13.58,11.81 10.03,15.36 10.03,16.89 LED22.3-GND 9.9,17.01 6.09,20.82 6.09,23.36 LED23.3-GND 5.96,23.49 5.96,24.38 3.04,27.3 3.04,29.84 3.42,30.22 LED24.3-GND 3.42,30.48 3.42,32.38
  Top 0.381: 35.43,67.69 35.3,67.81 35.3,72.64 34.41,73.53 34.41,76.2 34.29,76.32 | U2.3 47.37,41.65 48,41.65 U2.2 48.13,41.78 48.13,42.79 55.62,50.29 | 55.62,50.29 60.7,55.37 VL3.GND | 55.62,50.29 59.69,46.22 65.02,46.22 VL4.GND | C3.- 34.67,41.27 35.94,40 R3.2 38.22,39.87 38.86,39.24 39.62,39.24 41.27,40.89 | 41.27,40.89 41.4,41.02 41.4,41.52 U2.12 | 37.46,36.83 35.94,36.83 34.67,35.56 C4.- | 37.46,36.83 R4.2 | v41.27,20.44 TP2.TP | v46.6,33.9 46.6,35.81 U2.21 | v37.46,36.7 37.46,36.83 | v41.91,40.25 41.27,40.89 | VL10.GND 26.67,17.9 26.67,18.92 21.08,24.51 19.3,24.51 VL11.GND | LED31.3-GND 23.36,73.91 20.82,73.91 17.01,70.1 LED30.3-GND 17.01,69.97 15.36,69.97 11.81,66.42 11.81,65.02 LED29.3-GND 11.55,64.89 10.41,64.89 7.49,61.97 7.49,59.05 LED28.3-GND 7.36,58.92 6.73,58.92 4.44,56.64 4.44,52.32 LED27.3-GND 4.31,52.19 2.41,50.29 2.41,45.08 LED26.3-GND 2.54,44.95 1.39,43.81 1.39,41.52 2.28,40.64 2.28,37.71 LED25.3-GND 2.28,37.46 1.52,36.7 1.52,34.29 3.42,32.38 | 3.42,32.38 4.69,33.65 14.85,33.65 VL12.GND
  Bottom 0.381: 28.95,56.38 24.63,60.7 VL15.GND | 28.95,56.38 29.21,56.13 29.21,54.73 30.6,53.34 30.73,53.34 32,52.07 U1.13 32.13,52.07 v33.4,50.8 | 28.95,56.38 33.78,61.21 33.78,65.02 VL16.GND | VL4.GND 65.15,46.22 66.04,46.22 67.69,44.57 67.69,38.22 65.65,36.19 VL5.GND 66.04,36.32 67.43,34.92 67.43,31.36 62.86,26.79 62.35,26.79 VL6.GND 62.1,26.67 61.08,26.67 57.27,22.86 | 57.27,22.86 55.49,21.08 55.49,19.3 VL7.GND | 41.27,19.93 v41.27,20.44 46.6,25.78 | 41.27,19.93 46.22,14.98 VL8.GND | 46.6,25.78 v46.6,33.9 43.81,36.7 42.92,36.7 | 42.92,36.7 v37.46,36.7 | VL9.GND 36.19,16.25 36.32,16.38 | 36.32,16.38 39.75,19.81 41.14,19.81 41.27,19.93 | v41.91,40.25 42.41,40.25 42.92,39.75 42.92,36.7 | 57.27,22.86 56.89,23.24 56.76,23.24 54.35,25.65 46.73,25.65 46.6,25.78 | VL14.GND 17.78,53.21 17.14,53.21 13.08,49.14 13.08,45.08 14.22,43.94 VL13.GND 14.35,43.81 12.31,41.78 12.31,35.43 13.97,33.78 14.85,33.78 VL12.GND 14.47,33.65 14.47,27.55 17.39,24.63 19.17,24.63 VL11.GND | 36.32,16.38 32.13,20.57 29.46,20.57 26.79,17.9 VL10.GND
  other vias: 13,13 40,72 72,40 8,40 40,8 34,30 34,17 26,24 29,21 22,33 24,36 24,31 31,33 28,36 42,51 40,53 40,59 37,61 28,48 26,51 20,52 23,46 25,47 17,46 21,45 27,39 21,39 16.5,43 56,38 60,38 62,34 44,43.5
  pour Bottom: 2.52,41.18 2.52,38.82 2.67,36.47 2.96,34.13 3.4,31.82 3.99,29.54 4.72,27.3 5.58,25.11 6.59,22.98 7.72,20.91 8.98,18.92 10.37,17.02 11.87,15.2 13.48,13.48 15.2,11.87 17.02,10.37 18.92,8.98 20.91,7.72 22.98,6.59 25.11,5.58 27.3,4.72 29.54,3.99 31.82,3.4 34.13,2.96 36.47,2.67 38.82,2.52 41.18,2.52 43.53,2.67 45.87,2.96 48.18,3.4 50.46,3.99 52.7,4.72 54.89,5.58 57.02,6.59 59.09,7.72 61.08,8.98 62.98,10.37 64.8,11.87 66.52,13.48 68.13,15.2 69.63,17.02 71.02,18.92 72.28,20.91 73.41,22.98 74.42,25.11 75.28,27.3 76.01,29.54 76.6,31.82 77.04,34.13 77.33,36.47 77.48,38.82 77.48,41.18 77.33,43.53 77.04,45.87 76.6,48.18 76.01,50.46 75.28,52.7 74.42,54.89 73.41,57.02 72.28,59.09 71.02,61.08 69.63,62.98 68.13,64.8 66.52,66.52 64.8,68.13 62.98,69.63 61.08,71.02 59.09,72.28 57.02,73.41 54.89,74.42 52.7,75.28 50.46,76.01 48.18,76.6 45.87,77.04 43.53,77.33 41.18,77.48 38.82,77.48 36.47,77.33 34.13,77.04 31.82,76.6 29.54,76.01 27.3,75.28 25.11,74.42 22.98,73.41 20.91,72.28 18.92,71.02 17.02,69.63 15.2,68.13 13.48,66.52 11.87,64.8 10.37,62.98 8.98,61.08 7.72,59.09 6.59,57.02 5.58,54.89 4.72,52.7 3.99,50.46 3.4,48.18 2.96,45.87 2.67,43.53
  pour Top: 0,80 80,80 80,0 0,0
LED_SIG  (via drill 0.3)
  Top 0.381: v36.57,29.21 TP5.TP | v28.7,53.97 v28.7,51.81 | v23.24,60.32 23.24,61.34 v25.52,63.62 | v36.57,74.67 37.33,74.67 37.59,74.42 LED1.4-DIN
  Bottom 0.381: v36.57,29.21 36.06,29.21 28.7,36.57 v28.7,51.81 | v28.7,53.97 28.7,54.86 v23.24,60.32 | v36.57,74.67 v25.52,63.62
N$1
  Top 0.381: LED2.4-DIN 44.32,74.16 44.32,75.69 42.41,77.59 LED1.2-DOUT
N$2
  Top 0.381: LED2.2-DOUT 49.65,76.45 49.65,74.29 50.92,73.02 50.92,72.64 LED3.4-DIN
N$3
  Top 0.381: LED3.2-DOUT 56.64,73.78 56.64,70.35 57.02,69.97 LED4.4-DIN
N$4
  Top 0.381: LED5.4-DIN 62.73,66.04 62.73,69.85 62.86,69.97 LED4.2-DOUT
N$5
  Top 0.381: LED6.4-DIN 67.31,61.08 67.31,64 68.19,64.89 LED5.2-DOUT
N$6
  Top 0.381: LED7.4-DIN 70.86,55.37 70.86,56.51 72.51,58.16 72.51,58.92 LED6.2-DOUT
N$7
  Top 0.381: LED8.4-DIN 73.27,49.02 73.27,49.91 75.56,52.19 LED7.2-DOUT
N$8
  Top 0.381: LED9.4-DIN 74.42,42.41 74.8,42.41 77.34,44.95 LED8.2-DOUT
N$9
  Top 0.381: LED11.4-DIN 72.64,29.08 75.18,29.08 76.45,30.35 LED10.2-DOUT
N$10
  Top 0.381: LED12.4-DIN 69.97,22.98 73.4,22.98 73.78,23.36 LED11.2-DOUT
N$11
  Top 0.381: LED13.4-DIN 66.04,17.27 69.85,17.27 69.97,17.14 LED12.2-DOUT
N$12
  Top 0.381: LED14.4-DIN 61.08,12.7 64,12.7 64.89,11.81 LED13.2-DOUT
N$13
  Top 0.381: LED15.4-DIN 55.37,9.14 56.51,9.14 58.16,7.49 58.92,7.49 LED14.2-DOUT
N$14
  Top 0.381: LED16.4-DIN 49.02,6.73 49.91,6.73 52.19,4.44 LED15.2-DOUT
N$15
  Top 0.381: LED17.4-DIN 42.41,5.58 42.41,5.2 44.95,2.66 LED16.2-DOUT
N$16
  Top 0.381: LED18.4-DIN 35.68,5.84 35.68,4.31 37.59,2.41 LED17.2-DOUT
N$17
  Top 0.381: LED19.2-DOUT 23.36,6.22 23.36,9.65 22.98,10.03 LED20.4-DIN
N$18
  Top 0.381: LED20.2-DOUT 17.14,10.03 17.14,13.84 17.27,13.97 LED21.4-DIN
N$19
  Top 0.381: LED21.2-DOUT 11.81,15.11 11.81,18.03 12.7,18.92 LED22.4-DIN
N$20
  Top 0.381: LED22.2-DOUT 7.49,21.08 7.49,22.98 9.14,24.63 LED23.4-DIN
N$21
  Top 0.381: LED23.2-DOUT 4.44,27.81 4.44,28.7 6.73,30.98 LED24.4-DIN
N$22
  Top 0.381: LED24.2-DOUT 2.66,35.05 3.04,35.05 5.58,37.59 LED25.4-DIN
N$23
  Top 0.381: R3.1 39.24,41.14 39.37,41.27 LED40.C
N$24
  Top 0.381: R4.1 39.24,35.68 39.37,35.56 LED41.C
N$25
  Top 0.381: R5.1 50.16,41.65 48.76,41.65 U2.1
N$26
  Top 0.381: LED25.2-DOUT 2.41,42.41 3.93,42.41 5.84,44.32 LED26.4-DIN
N$27
  Top 0.381: LED26.2-DOUT 3.55,49.65 5.71,49.65 6.98,50.92 7.36,50.92 LED27.4-DIN
N$28
  Top 0.381: LED10.4-DIN 74.16,35.68 75.69,35.68 77.59,37.59 LED9.2-DOUT
N$29
  Top 0.381: LED29.4-DIN 13.97,62.73 10.16,62.73 10.03,62.86 LED28.2-DOUT
N$30
  Top 0.381: LED30.4-DIN 18.92,67.31 16,67.31 15.11,68.19 LED29.2-DOUT
N$31
  Top 0.381: LED31.4-DIN 24.63,70.86 23.49,70.86 21.84,72.51 21.08,72.51 LED30.2-DOUT
N$32
  Top 0.381: LED32.4-DIN 30.98,73.27 30.09,73.27 27.81,75.56 LED31.2-DOUT
N$33
  Top 0.381: LED18.2-DOUT 30.35,3.55 30.35,5.71 29.08,6.98 29.08,7.36 LED19.4-DIN
N$34
  Top 0.381: LED27.2-DOUT 6.22,56.64 9.65,56.64 10.03,57.02 LED28.4-DIN
RX  (via drill 0.3)
  Top 0.381: TP3.TP 38.73,27.94 36.95,27.94 35.94,28.95 v35.94,32.51
  Bottom 0.381: v35.94,32.51 35.94,35.43 32.13,39.24 U1.8
SCL  (via drill 0.3)
  Top 0.381: U2.22 47.37,35.94 47.37,36.7 47.75,37.08 48.89,37.08 49.27,36.7 R2.1 50.29,36.83 50.54,36.83 v50.92,37.21 | v34.41,67.69 31.49,64.77 31.49,64.26 VL16.SCL | v37.46,67.05 39.11,67.05 40.51,65.65 41.27,65.65 VL1.SCL | 66.92,29.84 66.92,27.05 60.96,21.08 57.27,21.08 VL7.SCL 57.15,20.95 57.15,19.17 53.46,15.49 50.54,15.49 50.29,15.74 48.64,15.74 VL8.SCL 48.51,15.62 48.51,15.24 45.59,12.31 40.76,12.31 38.86,14.22 VL9.SCL 38.73,14.35 37.97,14.35 36.7,13.08 31.87,13.08 28.7,16.25 VL10.SCL 28.95,16.76 28.57,16.38 24.51,16.38 19.55,21.33 | 66.92,29.84 66.92,36.7 65.65,37.97 65.65,38.73 VL5.SCL | VL13.SCL 14.35,41.27 14.35,42.03 13.08,43.3 13.08,47.75 16.25,50.92 16.76,50.92 VL14.SCL 16.38,51.05 16.38,55.49 19.81,58.92 22.73,58.92 VL15.SCL | 19.55,21.33 15.49,25.4 15.49,29.46 15.74,29.71 15.74,31.36 VL12.SCL | v19.68,21.46 19.55,21.33 | 66.92,29.84 v65.02,29.84
  Bottom 0.381: U1.6 48.26,41.78 49.53,41.78 51.05,40.25 51.05,39.75 50.92,39.62 v50.92,37.21 49.14,35.43 49.14,34.67 50.03,33.78 | 50.03,33.78 55.24,28.57 61.21,28.57 61.59,28.95 63.11,28.95 VL6.SCL 63.24,29.21 64.38,29.21 v65.02,29.84 | 60.83,57.15 64.51,53.46 64.51,50.54 64.26,50.29 64.26,48.64 VL4.SCL 64,48.51 64,47.75 50.03,33.78 | 60.83,57.15 59.05,57.15 VL3.SCL | 60.83,57.15 62.48,58.8 62.48,62.1 60.96,63.62 52.95,63.62 52.57,63.24 51.05,63.24 VL2.SCL 50.92,63.37 50.92,63.75 46.99,67.69 37.46,67.69 | 37.46,67.69 v34.41,67.69 | 37.46,67.69 v37.46,67.05 | v19.68,21.46 20.95,22.73 VL11.SCL 21.08,22.86 21.08,36.44 17.52,40 16.38,40 15.11,41.27 VL13.SCL
SDA  (via drill 0.3)
  Top 0.381: VL13.SDA 14.35,38.73 14.35,39.49 12.57,41.27 12.57,52.45 24.38,64.26 27.94,64.26 28.95,63.24 VL16.SDA | v46.22,59.43 46.22,62.35 48,64.13 48.51,64.13 VL2.SDA | v27.05,54.1 27.94,54.1 31.75,57.91 32.13,57.91 33.78,59.56 | 33.78,59.56 37.46,63.24 37.46,64.26 38.73,65.53 VL1.SDA | v32.13,60.45 32.89,60.45 33.78,59.56 | v49.78,34.92 49.53,34.67 48.38,34.67 48.13,34.92 48.13,35.81 U2.23 | v18.92,26.92 16.89,28.95 VL12.SDA | v32,13.84 31.49,14.35 31.49,15.74 VL10.SDA | 51.56,39.24 52.57,39.24 55.88,42.54 64.26,42.54 65.53,41.27 VL5.SDA | 51.56,39.24 R1.1 | v47.11,19.68 41.91,14.47 41.27,14.47 VL9.SDA 42.03,14.35 42.54,13.84 v42.54,12.95 | VL8.SDA 51.05,16.89 51.3,16.89 57.15,22.73 58.92,22.73 VL7.SDA 59.18,22.73 61.84,22.73 64.51,25.4 64.51,29.46 64.26,29.71 64.26,31.36 VL6.SDA | v51.56,39.11 51.56,39.24 | v58.54,55.88 57.27,57.15 57.27,58.92 VL3.SDA
  Bottom 0.381: 20.95,54.1 20.95,57.15 VL15.SDA | 20.95,54.1 20.95,48.38 18.79,46.22 17.65,46.22 15.87,48 15.87,48.51 VL14.SDA | VL1.SDA 38.73,64.89 40,63.62 40,62.48 43.68,58.8 46.22,58.8 | 46.22,58.8 57.02,58.8 57.15,58.92 VL3.SDA | 46.22,58.8 v46.22,59.43 | v27.05,54.1 20.95,54.1 | v32.13,60.45 31.11,59.43 29.46,59.43 28.57,60.32 28.57,61.21 28.95,61.59 28.95,63.11 VL16.SDA | v49.78,34.92 49.78,35.17 51.56,36.95 v51.56,39.11 51.56,41.14 49.53,43.18 | 49.53,43.18 48.26,44.45 U1.5 | 58.54,51.43 57.78,51.43 49.53,43.18 | 58.54,51.43 61.21,51.43 61.59,51.05 63.11,51.05 VL4.SDA | v18.92,26.92 20.44,25.4 20.44,24 19.05,22.6 19.05,21.2 19.43,20.82 19.93,20.82 20.06,20.95 22.73,20.95 VL11.SDA 22.73,20.82 22.73,18.16 27.05,13.84 v32,13.84 32.38,13.46 32.38,13.33 33.14,12.57 42.16,12.57 v42.54,12.95 | v47.11,19.68 48.51,19.68 49.4,20.57 50.54,20.57 51.43,19.68 51.43,17.27 51.05,16.89 VL8.SDA | VL5.SDA 65.65,41.27 65.65,40.51 66.92,39.24 66.92,38.22 66.16,37.46 65.02,37.46 64.26,36.7 64.26,35.68 65.02,34.92 66.67,34.92 66.92,34.67 66.92,32.63 65.78,31.49 64.26,31.49 VL6.SDA | 58.54,51.43 v58.54,55.88
TX  (via drill 0.3)
  Top 0.381: v38.1,28.57 TP4.TP | v45.97,32 46.99,32 v47.24,31.75
  Bottom 0.381: v38.1,28.57 42.54,28.57 v45.97,32 | v47.24,31.75 47.24,35.56 45.97,36.83 45.97,37.33 47.87,39.24 48.13,39.24 U1.7
VDD  (via drill 0.3)
  Top 0.381: 43.05,45.84 44.06,44.83 44.83,44.83 45.72,45.72 C2.1 | 43.05,45.84 43.05,48.89 D1.K | TP1.TP 42.54,29.46 v42.03,29.97 | v31.87,34.29 31.49,34.29 30.22,35.56 C4.+ | v39.62,44.06 39.62,45.33 REG1.1 | v42.67,45.72 42.92,45.72 43.05,45.84
  Bottom 0.381: v42.03,29.97 36.19,29.97 35.3,30.86 | v31.87,34.29 35.3,30.86 | 35.3,30.86 36.57,32.13 36.57,39.62 39.62,42.67 v39.62,44.06 41.27,45.72 v42.67,45.72
X1
  Top 0.254: VL1.X 41.27,62.99 39.62,61.34 39.62,61.08 R6.2 39.49,60.96 40.89,59.56 40.89,46.73 42.41,45.21 43.04,45.21 45.33,42.91 45.33,41.65 U2.6
X2  (via drill 0.3)
  Top 0.254: R7.2 47.62,59.69 48,59.69 49.02,60.7 49.91,60.7 VL2.X | v51.94,59.94 51.94,50.67 46.1,44.83 46.1,41.65 U2.5
  Bottom 0.254: v51.94,59.94 50.8,59.94 50.03,60.7 VL2.X
X3
  Top 0.254: VL3.X 57.15,55.37 57.02,55.24 54.61,55.24 R8.2 54.48,55.11 54.48,52.57 46.73,44.83 46.73,41.65 U2.4
X4  (via drill 0.3)
  Top 0.254: v58.54,48.26 58.67,48.38 59.18,48.38 R9.2 | v46.6,37.08 46.1,36.57 46.1,35.94 U2.20 | v52.45,40 v50.41,40
  Bottom 0.254: VL4.X 61.72,47.75 61.21,48.26 v58.54,48.26 58.54,45.72 52.83,40 v52.45,40 | v46.6,37.08 48.38,37.08 50.41,39.11 v50.41,40
X5
  Top 0.254: R10.2 61.08,40.38 61.34,40.38 62.99,38.73 VL5.X 63.11,38.73 63.11,32.13 62.86,31.87 62.86,30.6 61.97,29.71 61.97,29.33 61.34,28.7 56.51,28.7 53.72,31.49 48.26,31.49 45.46,34.29 45.46,35.81 U2.19
X6
  Top 0.254: VL6.X 60.7,30.09 60.7,30.98 59.69,32 59.69,32.38 R11.2 59.56,32.51 54.35,37.71 50.67,37.71 50.54,37.59 45.72,37.59 44.83,36.7 44.83,35.94 U2.18
X7
  Top 0.254: VL7.X 55.37,22.86 55.24,22.98 55.24,25.4 R12.2 55.11,25.52 51.68,25.52 44.19,33.02 44.19,35.81 U2.17
X8
  Top 0.254: VL8.X 47.75,18.28 48.38,18.92 48.38,20.7 R13.2 48.38,20.82 48.38,27.43 43.56,32.25 43.56,35.81 U2.16
X9
  Top 0.254: VL9.X 38.73,17.01 40.38,18.66 40.38,18.92 R14.2 40.51,18.92 43.56,21.97 43.56,31.62 42.92,32.25 42.92,35.81 U2.15
X10
  Top 0.254: VL10.X 30.09,19.3 30.98,19.3 32,20.32 32.38,20.32 R15.2 32.51,20.44 32.51,29.84 35.68,33.02 40,33.02 42.03,35.05 42.03,35.81 U2.14
X11  (via drill 0.3)
  Top 0.254: R16.2 25.4,24.76 22.98,24.76 22.86,24.63 VL11.X | v25.52,37.84 41.52,37.84 44.06,40.38 44.06,41.52 U2.8
  Bottom 0.254: v25.52,37.84 25.52,27.3 22.86,24.63 VL11.X
X12  (via drill 0.3)
  Top 0.254: 19.68,31.62 18.92,31.62 18.28,32.25 VL12.X | 19.68,31.62 20.7,31.62 R17.2 | v30.22,44.32 35.3,44.32 37.08,46.1 40.64,46.1 43.91,42.83 44.29,42.83 44.7,42.41 44.7,41.65 U2.7 | v29.33,36.95 23.87,36.95 19.68,32.76 19.68,31.62
  Bottom 0.254: v30.22,44.32 30.22,37.84 v29.33,36.95
X13
  Top 0.254: VL13.X 17.01,41.27 18.66,39.62 18.92,39.62 R18.2 19.05,39.49 20.19,38.35 41.4,38.35 43.43,40.38 43.43,41.52 U2.9
X14
  Top 0.254: VL14.X 19.3,49.91 19.3,49.02 20.32,48 20.32,47.62 R19.2 20.44,47.49 20.44,46.73 28.44,38.73 41.14,38.73 42.79,40.38 42.79,41.52 U2.10
X15
  Top 0.254: VL15.X 24.63,57.15 24.76,57.02 24.76,54.61 R20.2 24.89,54.48 24.89,48.89 30.22,43.56 40.89,43.56 42.03,42.41 42.03,41.65 U2.11
X16
  Top 0.254: VL16.X 32.25,61.72 31.62,61.08 31.62,59.3 R21.2 31.49,59.18 24.89,59.18 21.59,55.88 21.59,55.24 18.16,51.81 18.16,50.67 17.9,50.41 17.9,49.14 17.01,48.26 17.01,47.87 15.74,46.6 15.74,40.76 16.51,40 17.39,40 20.06,37.33 25.78,37.33 25.9,37.46 39.62,37.46 41.14,35.94 41.4,35.94 U2.13